# Altium schematic sheet SYSTEM.SchDoc
size A3
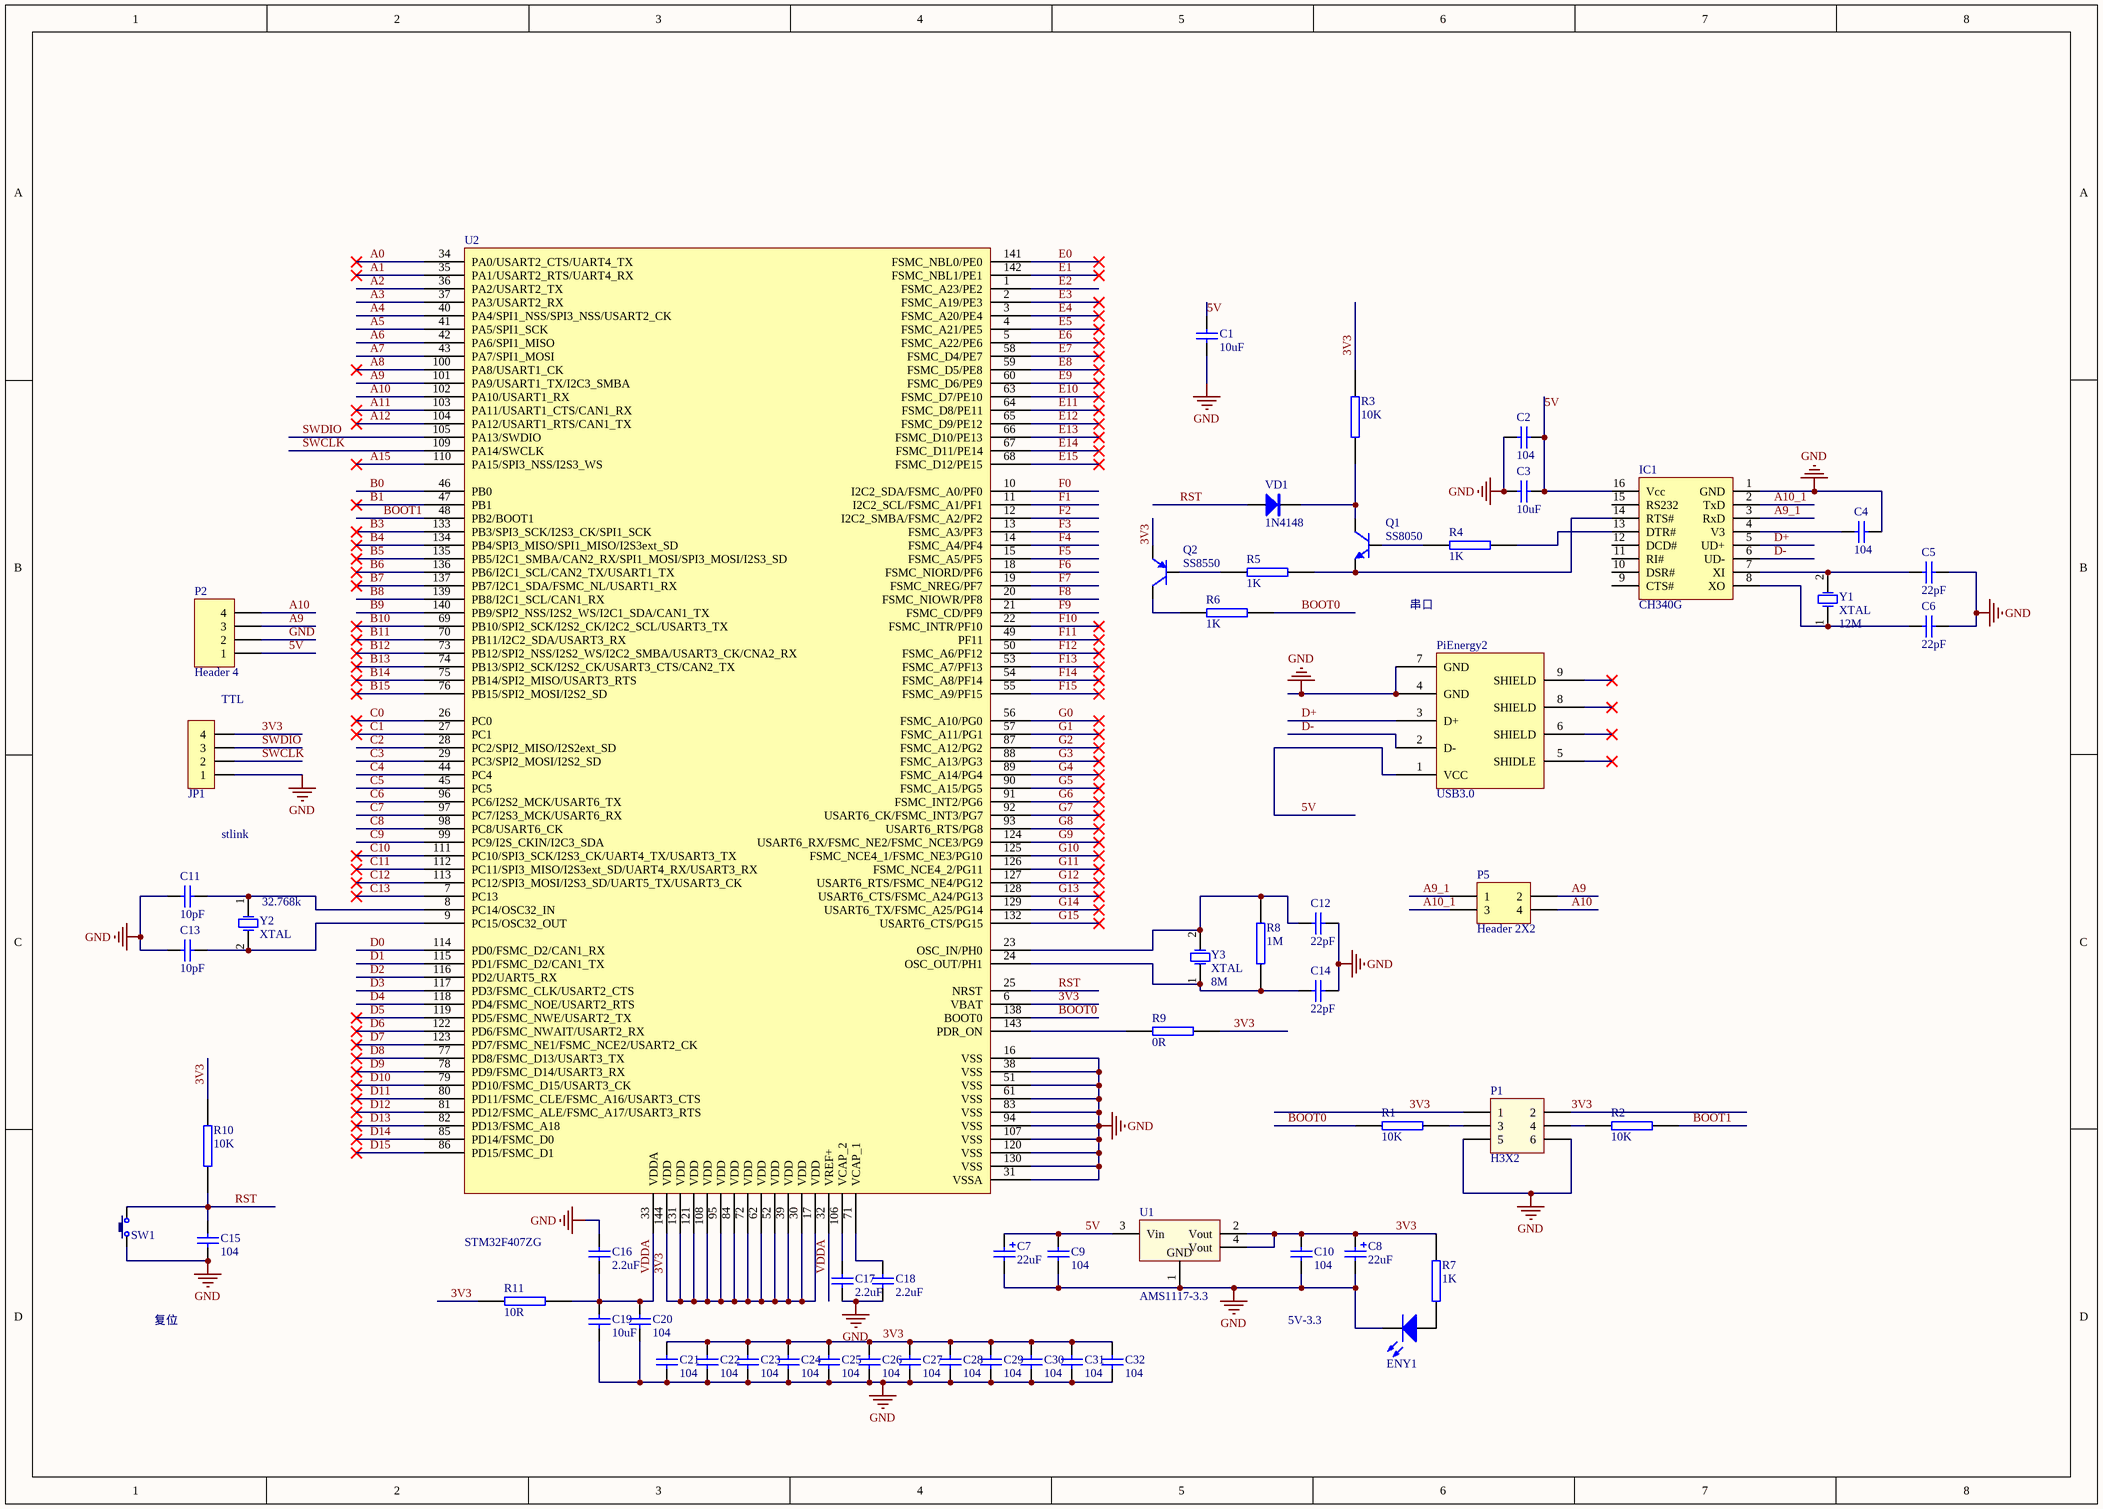
[diagram p0: SYSTEM.SchDoc]

## Parts
C1  Cap  [CAP[0805]]  (value not drawn)
C2  Cap  [CAP[0805]]  (value not drawn)
C3  Cap  [CAP[0805]]  (value not drawn)
C4  Cap  [CAP[0805]]  (value not drawn)
C5  Cap  [CAP[0805]]  (value not drawn)
C6  Cap  [CAP[0805]]  (value not drawn)
C7  Cap Pol(22uF)  [CAP[1210]]  (value not drawn)
C8  Cap Pol(22uF)  [CAP[1210]]  (value not drawn)
C9  Cap  [CAP[0805]]  (value not drawn)
C10  Cap  [CAP[0805]]  (value not drawn)
C11  Cap  [CAP[0805]]  (value not drawn)
C12  Cap  [CAP[0805]]  (value not drawn)
C13  Cap  [CAP[0805]]  (value not drawn)
C14  Cap  [CAP[0805]]  (value not drawn)
C15  Cap  [CAP[0805]]  (value not drawn)
C16  Cap  [CAP[0805]]  (value not drawn)
C17  Cap  [CAP[0805]]  (value not drawn)
C18  Cap  [CAP[0805]]  (value not drawn)
C19  Cap  [CAP[0805]]  (value not drawn)
C20  Cap  [CAP[0805]]  (value not drawn)
C21  Cap  [CAP[0805]]  (value not drawn)
C22  Cap  [CAP[0805]]  (value not drawn)
C23  Cap  [CAP[0805]]  (value not drawn)
C24  Cap  [CAP[0805]]  (value not drawn)
C25  Cap  [CAP[0805]]  (value not drawn)
C26  Cap  [CAP[0805]]  (value not drawn)
C27  Cap  [CAP[0805]]  (value not drawn)
C28  Cap  [CAP[0805]]  (value not drawn)
C29  Cap  [CAP[0805]]  (value not drawn)
C30  Cap  [CAP[0805]]  (value not drawn)
C31  Cap  [CAP[0805]]  (value not drawn)
C32  Cap  [CAP[0805]]  (value not drawn)
ENY1  LED0  [LED[0805]]  (value not drawn)
IC1  CH340G  [SOP16_M]
JP1  HDR-1X4  [HDR-1X4_M]  (value not drawn)
P1  H3X2  [H2.54-2X3]
P2  Header 4  [HDR1X4]
P5  Header 2X2  [HDR2X2]
PiEnergy2  USB3.0  [USB3.0]
Q1  SS8050  [SOT23-3M]
Q2  SS8550  [SOT23-3M]
R1  10K  [R0805]
R2  10K  [R0805]
R3  10K  [R0805]
R4  1K  [R0805]
R5  1K  [R0805]
R6  1K  [R0805]
R7  1K  [R0805]
R8  1M  [R0805]
R9  0R  [R0805]
R10  10K  [R0805]
R11  10R  [R0805]
SW1  3x6x5  [TSW SMD-3*6*2.5]  (value not drawn)
U1  AMS1117-3.3  [SOT-223(AMS1117-3.3)]
U2  STM32F407ZG  [LQFP144 20X20_M]
VD1  1N4148  [MINI_MELF (LL34)]
Y1  XTAL  [XTAL]
Y2  XTAL  [XTAL-DT38-SMD]
Y3  XTAL  [XTAL]

## Nets
GND: C1.1 C2.1 C3.1 C4.2 C5.2 C6.2 C7.2 C8.2 C9.1 C10.1 C11.1 C12.2 C13.1 C14.2 C15.1 C16.2 C17.1 C18.1 C19.1 C20.1 C21.1 C22.1 C23.1 C24.1 C25.1 C26.1 C27.1 C28.1 C29.1 C30.1 C31.1 C32.1 ENY1.2(K) IC1.1(GND) JP1.1 P1.5 P1.6 P2.2 PiEnergy2.4(GND) PiEnergy2.7(GND) SW1.1 U1.1(GND) U2.16(VSS) U2.31(VSSA) U2.38(VSS) U2.51(VSS) U2.61(VSS) U2.83(VSS) U2.94(VSS) U2.107(VSS) U2.120(VSS) U2.130(VSS)
3V3: C8.1 C10.2 C21.2 C22.2 C23.2 C24.2 C25.2 C26.2 C27.2 C28.2 C29.2 C30.2 C31.2 C32.2 JP1.4 P1.1 P1.2 Q2.2(E) R3.2 R7.2 R9.2 R10.2 R11.1 U1.2(Vout) U1.4(Vout) U2.6(VBAT) U2.17(VDD) U2.30(VDD) U2.39(VDD) U2.52(VDD) U2.62(VDD) U2.72(VDD) U2.84(VDD) U2.95(VDD) U2.108(VDD) U2.121(VDD) U2.131(VDD) U2.144(VDD)
5V: C1.2 C2.2 C3.2 C7.1 C9.2 IC1.16(Vcc) P2.1 PiEnergy2.1(VCC) U1.3(Vin)
A0: U2.34(PA0/USART2_CTS/UART4_TX)
A1: U2.35(PA1/USART2_RTS/UART4_RX)
A2: U2.36(PA2/USART2_TX)
A3: U2.37(PA3/USART2_RX)
A4: U2.40(PA4/SPI1_NSS/SPI3_NSS/USART2_CK)
A5: U2.41(PA5/SPI1_SCK)
A6: U2.42(PA6/SPI1_MISO)
A7: U2.43(PA7/SPI1_MOSI)
A8: U2.100(PA8/USART1_CK)
A9: P2.3 P5.2 U2.101(PA9/USART1_TX/I2C3_SMBA)
A9_1: IC1.3(RxD) P5.1
A10: P2.4 P5.4 U2.102(PA10/USART1_RX)
A10_1: IC1.2(TxD) P5.3
A11: U2.103(PA11/USART1_CTS/CAN1_RX)
A12: U2.104(PA12/USART1_RTS/CAN1_TX)
A15: U2.110(PA15/SPI3_NSS/I2S3_WS)
B0: U2.46(PB0)
B1: U2.47(PB1)
B3: U2.133(PB3/SPI3_SCK/I2S3_CK/SPI1_SCK)
B4: U2.134(PB4/SPI3_MISO/SPI1_MISO/I2S3ext_SD)
B5: U2.135(PB5/I2C1_SMBA/CAN2_RX/SPI1_MOSI/SPI3_MOSI/I2S3_SD)
B6: U2.136(PB6/I2C1_SCL/CAN2_TX/USART1_TX)
B7: U2.137(PB7/I2C1_SDA/FSMC_NL/USART1_RX)
B8: U2.139(PB8/I2C1_SCL/CAN1_RX)
B9: U2.140(PB9/SPI2_NSS/I2S2_WS/I2C1_SDA/CAN1_TX)
B10: U2.69(PB10/SPI2_SCK/I2S2_CK/I2C2_SCL/USART3_TX)
B11: U2.70(PB11/I2C2_SDA/USART3_RX)
B12: U2.73(PB12/SPI2_NSS/I2S2_WS/I2C2_SMBA/USART3_CK/CNA2_RX)
B13: U2.74(PB13/SPI2_SCK/I2S2_CK/USART3_CTS/CAN2_TX)
B14: U2.75(PB14/SPI2_MISO/USART3_RTS)
B15: U2.76(PB15/SPI2_MOSI/I2S2_SD)
BOOT0: R1.1 R6.1 U2.138(BOOT0)
BOOT1: R2.2 U2.48(PB2/BOOT1)
C0: U2.26(PC0)
C1: U2.27(PC1)
C2: U2.28(PC2/SPI2_MISO/I2S2ext_SD)
C3: U2.29(PC3/SPI2_MOSI/I2S2_SD)
C4: U2.44(PC4)
C5: U2.45(PC5)
C6: U2.96(PC6/I2S2_MCK/USART6_TX)
C7: U2.97(PC7/I2S3_MCK/USART6_RX)
C8: U2.98(PC8/USART6_CK)
C9: U2.99(PC9/I2S_CKIN/I2C3_SDA)
C10: U2.111(PC10/SPI3_SCK/I2S3_CK/UART4_TX/USART3_TX)
C11: U2.112(PC11/SPI3_MISO/I2S3ext_SD/UART4_RX/USART3_RX)
C12: U2.113(PC12/SPI3_MOSI/I2S3_SD/UART5_TX/USART3_CK)
C13: U2.7(PC13)
D0: U2.114(PD0/FSMC_D2/CAN1_RX)
D1: U2.115(PD1/FSMC_D2/CAN1_TX)
D2: U2.116(PD2/UART5_RX)
D3: U2.117(PD3/FSMC_CLK/USART2_CTS)
D4: U2.118(PD4/FSMC_NOE/USART2_RTS)
D5: U2.119(PD5/FSMC_NWE/USART2_TX)
D6: U2.122(PD6/FSMC_NWAIT/USART2_RX)
D7: U2.123(PD7/FSMC_NE1/FSMC_NCE2/USART2_CK)
D8: U2.77(PD8/FSMC_D13/USART3_TX)
D9: U2.78(PD9/FSMC_D14/USART3_RX)
D10: U2.79(PD10/FSMC_D15/USART3_CK)
D11: U2.80(PD11/FSMC_CLE/FSMC_A16/USART3_CTS)
D12: U2.81(PD12/FSMC_ALE/FSMC_A17/USART3_RTS)
D13: U2.82(PD13/FSMC_A18)
D14: U2.85(PD14/FSMC_D0)
D15: U2.86(PD15/FSMC_D1)
D+: IC1.5(UD+) PiEnergy2.3(D+)
D-: IC1.6(UD-) PiEnergy2.2(D-)
E0: U2.141(FSMC_NBL0/PE0)
E1: U2.142(FSMC_NBL1/PE1)
E2: U2.1(FSMC_A23/PE2)
E3: U2.2(FSMC_A19/PE3)
E4: U2.3(FSMC_A20/PE4)
E5: U2.4(FSMC_A21/PE5)
E6: U2.5(FSMC_A22/PE6)
E7: U2.58(FSMC_D4/PE7)
E8: U2.59(FSMC_D5/PE8)
E9: U2.60(FSMC_D6/PE9)
E10: U2.63(FSMC_D7/PE10)
E11: U2.64(FSMC_D8/PE11)
E12: U2.65(FSMC_D9/PE12)
E13: U2.66(FSMC_D10/PE13)
E14: U2.67(FSMC_D11/PE14)
E15: U2.68(FSMC_D12/PE15)
F0: U2.10(I2C2_SDA/FSMC_A0/PF0)
F1: U2.11(I2C2_SCL/FSMC_A1/PF1)
F2: U2.12(I2C2_SMBA/FSMC_A2/PF2)
F3: U2.13(FSMC_A3/PF3)
F4: U2.14(FSMC_A4/PF4)
F5: U2.15(FSMC_A5/PF5)
F6: U2.18(FSMC_NIORD/PF6)
F7: U2.19(FSMC_NREG/PF7)
F8: U2.20(FSMC_NIOWR/PF8)
F9: U2.21(FSMC_CD/PF9)
F10: U2.22(FSMC_INTR/PF10)
F11: U2.49(PF11)
F12: U2.50(FSMC_A6/PF12)
F13: U2.53(FSMC_A7/PF13)
F14: U2.54(FSMC_A8/PF14)
F15: U2.55(FSMC_A9/PF15)
G0: U2.56(FSMC_A10/PG0)
G1: U2.57(FSMC_A11/PG1)
G2: U2.87(FSMC_A12/PG2)
G3: U2.88(FSMC_A13/PG3)
G4: U2.89(FSMC_A14/PG4)
G5: U2.90(FSMC_A15/PG5)
G6: U2.91(FSMC_INT2/PG6)
G7: U2.92(USART6_CK/FSMC_INT3/PG7)
G8: U2.93(USART6_RTS/PG8)
G9: U2.124(USART6_RX/FSMC_NE2/FSMC_NCE3/PG9)
G10: U2.125(FSMC_NCE4_1/FSMC_NE3/PG10)
G11: U2.126(FSMC_NCE4_2/PG11)
G12: U2.127(USART6_RTS/FSMC_NE4/PG12)
G13: U2.128(USART6_CTS/FSMC_A24/PG13)
G14: U2.129(USART6_TX/FSMC_A25/PG14)
G15: U2.132(USART6_CTS/PG15)
RST: C15.2 R10.1 SW1.2 U2.25(NRST) VD1.1(A)
SWCLK: JP1.2 U2.109(PA14/SWCLK)
SWDIO: JP1.3 U2.105(PA13/SWDIO)
VDDA: C16.1 C19.2 C20.2 R11.2 U2.32(VREF+) U2.33(VDDA)
NetC4_1: C4.1 IC1.4(V3)
NetC5_1: C5.1 IC1.7(XI) Y1.2(OSC2)
NetC6_1: C6.1 IC1.8(XO) Y1.1(OSC1)
NetC11_2: C11.2 U2.8(PC14/OSC32_IN) Y2.1(OSC1)
NetC12_1: C12.1 R8.2 U2.23(OSC_IN/PH0) Y3.2(OSC2)
NetC13_2: C13.2 U2.9(PC15/OSC32_OUT) Y2.2(OSC2)
NetC14_1: C14.1 R8.1 U2.24(OSC_OUT/PH1) Y3.1(OSC1)
NetC17_2: C17.2 U2.106(VCAP_2)
NetC18_2: C18.2 U2.71(VCAP_1)
NetENY1_1: ENY1.1(A) R7.1
NetIC1_13: IC1.13(DTR#) R4.2
NetIC1_14: IC1.14(RTS#) Q1.2(E) R5.2
NetP1_3: P1.3 R1.2
NetP1_4: P1.4 R2.1
NetQ1_1: Q1.1(B) R4.1
NetQ1_3: Q1.3(C) R3.1 VD1.2(K)
NetQ2_1: Q2.1(B) R5.1
NetQ2_3: Q2.3(C) R6.2
NetR9_1: R9.1 U2.143(PDR_ON)

Not connected (* = marked no-connect by the designer): IC1 9(CTS#) 10(DSR#) 11(RI#) 12(DCD#) 15(RS232); PiEnergy2 5(SHIDLE)* 6(SHIELD)* 8(SHIELD)* 9(SHIELD)*

## Notes on the sheet
- 串口
- TTL
- stlink
- 复位
- 5V-3.3
- (in symbol Cap) 104; 10uF; 2.2uF; 10pF; 22pF
- (in symbol Cap Pol(22uF)) 22uF
- (in symbol XTAL) 32.768k
- (in symbol XTAL_1) 12M; 8M

## Library data of the parts
IC1 = CH340G: 串口转USB; 版权归属: 源创客; BOM名称: 串口转USB; 学习资源: www.ooocke.com
JP1 = Header 4: 4P接插件; 版权归属: 源创客; BOM名称: 4P接插件; 学习资源: www.ooocke.com
P2 = Header 4: Header, 4-Pin; LatestRevisionDate: 17-Jul-2002; LatestRevisionNote: Re-released for DXP Platform.; Publisher: Altium Limited
P5 = Header 2X2: Header, 2-Pin, Dual row; LatestRevisionDate: 17-Jul-2002; LatestRevisionNote: Re-released for DXP Platform.; Publisher: Altium Limited
Q1 = 8050-SMD: 高频放大-NPN型; 版权归属: 源创客; 属性: 40V 1.5A 1W 100MHZ; BOM名称: 高频放大-NPN型; 学习资源: www.ooocke.com
Q2 = 8550-SMD: 高频放大-PNP型; 版权归属: 源创客; 属性: 40V 1.5A 1W 100MHZ; BOM名称: 高频放大-PNP型; 学习资源: www.ooocke.com
R1-R11 = RES
SW1 = TSW 3x6: 3x6轻触开关; 版权归属: 源创客; BOM名称: 3x6轻触开关; 学习资源: www.ooocke.com
U2 = STM32F407ZG: Flaah:1024/RAM:192/IO:114; BOM名称: 32位ST单片机; 版权归属: 源创客; 学习资源: www.ooocke.com
VD1 = 1N4148: 高速开关二极管; 版权归属: 源创客; BOM名称: 高速开关二极管; 学习资源: www.ooocke.com
Y1 Y3 = XTAL_1